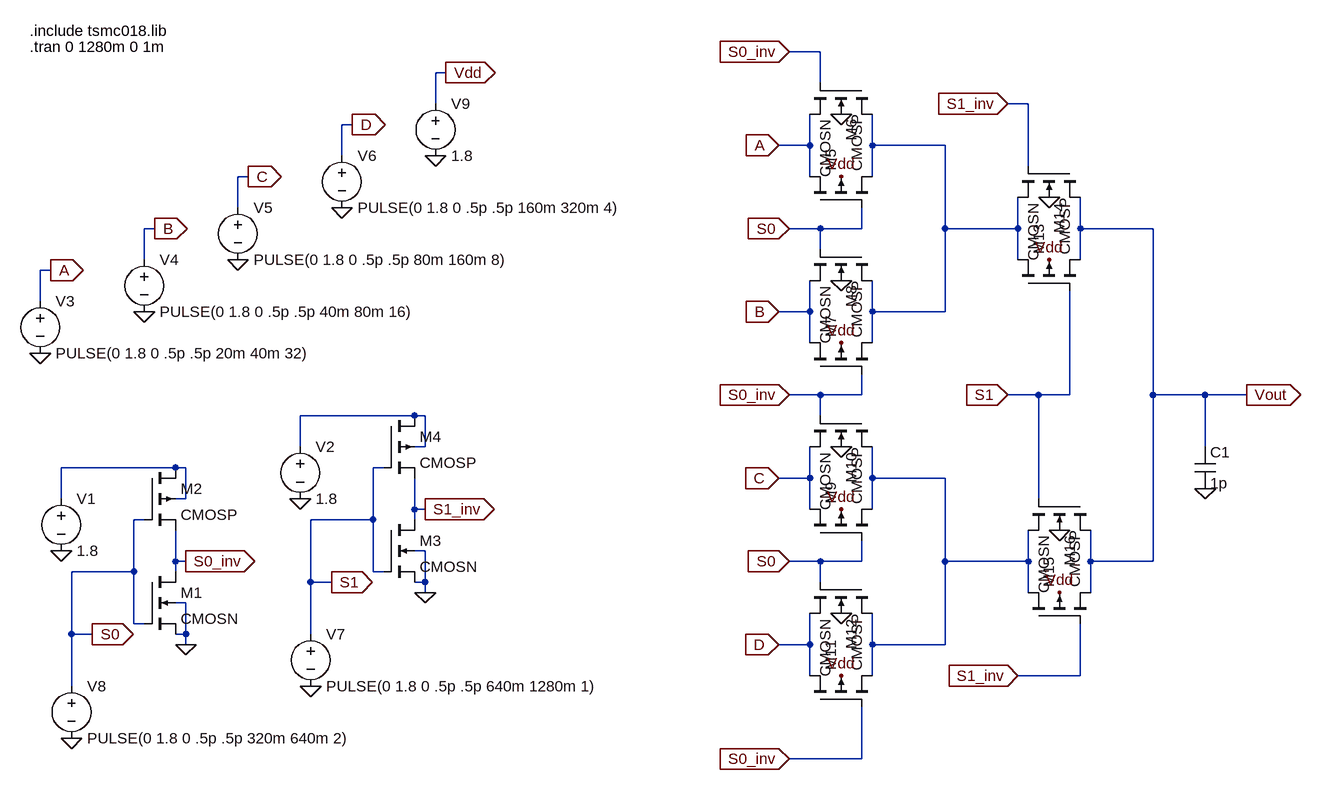
[diagram p0: schematic MUX.asc]
MUX.asc, the LTspice schematic file:
Version 4
SHEET 1 1568 872
WIRE 800 -320 752 -320
WIRE 224 -288 208 -288
WIRE 800 -272 800 -320
WIRE 208 -240 208 -288
WIRE 1120 -240 1088 -240
WIRE 80 -208 64 -208
WIRE 784 -176 784 -224
WIRE 784 -176 736 -176
WIRE 880 -176 880 -224
WIRE 992 -176 880 -176
WIRE 64 -160 64 -208
WIRE 1120 -144 1120 -240
WIRE -80 -128 -96 -128
WIRE 784 -128 784 -176
WIRE 880 -128 880 -176
WIRE -96 -80 -96 -128
WIRE -224 -48 -240 -48
WIRE 800 -48 752 -48
WIRE 864 -48 864 -80
WIRE 864 -48 800 -48
WIRE 992 -48 992 -176
WIRE 1104 -48 1104 -96
WIRE 1104 -48 992 -48
WIRE 1200 -48 1200 -96
WIRE 1312 -48 1200 -48
WIRE 800 -16 800 -48
WIRE -240 0 -240 -48
WIRE 1104 0 1104 -48
WIRE 1200 0 1200 -48
WIRE -384 16 -400 16
WIRE -400 64 -400 16
WIRE 784 80 784 32
WIRE 784 80 736 80
WIRE 880 80 880 32
WIRE 992 80 992 -48
WIRE 992 80 880 80
WIRE 784 128 784 80
WIRE 880 128 880 80
WIRE 800 208 752 208
WIRE 864 208 864 176
WIRE 864 208 800 208
WIRE 1136 208 1088 208
WIRE 1184 208 1184 48
WIRE 1184 208 1136 208
WIRE 1312 208 1312 -48
WIRE 1392 208 1312 208
WIRE 1456 208 1392 208
WIRE 176 240 0 240
WIRE 192 240 176 240
WIRE 800 240 800 208
WIRE 0 288 0 240
WIRE 192 288 192 240
WIRE 192 288 176 288
WIRE 1392 288 1392 208
WIRE -192 320 -368 320
WIRE -176 320 -192 320
WIRE 128 320 112 320
WIRE 784 336 784 288
WIRE 784 336 736 336
WIRE 880 336 880 288
WIRE 992 336 880 336
WIRE -368 368 -368 320
WIRE -176 368 -176 320
WIRE -176 368 -192 368
WIRE 1136 368 1136 208
WIRE 176 384 176 336
WIRE 192 384 176 384
WIRE 784 384 784 336
WIRE 880 384 880 336
WIRE -240 400 -256 400
WIRE 112 400 112 320
WIRE 112 400 16 400
WIRE 176 400 176 384
WIRE 192 448 176 448
WIRE -192 464 -192 416
WIRE -176 464 -192 464
WIRE 800 464 752 464
WIRE 864 464 864 432
WIRE 864 464 800 464
WIRE 992 464 992 336
WIRE 1120 464 1120 416
WIRE 1120 464 992 464
WIRE 1216 464 1216 416
WIRE 1312 464 1312 208
WIRE 1312 464 1216 464
WIRE -256 480 -256 400
WIRE -256 480 -352 480
WIRE -192 480 -192 464
WIRE 112 480 112 400
WIRE 128 480 112 480
WIRE 16 496 16 400
WIRE 48 496 16 496
WIRE 192 496 192 448
WIRE 192 496 176 496
WIRE 800 496 800 464
WIRE 192 512 192 496
WIRE 1120 512 1120 464
WIRE 1216 512 1216 464
WIRE -176 528 -192 528
WIRE -256 560 -256 480
WIRE -240 560 -256 560
WIRE -352 576 -352 480
WIRE -320 576 -352 576
WIRE -176 576 -176 528
WIRE -176 576 -192 576
WIRE 16 576 16 496
WIRE -176 592 -176 576
WIRE 784 592 784 544
WIRE 784 592 736 592
WIRE 880 592 880 544
WIRE 992 592 992 464
WIRE 992 592 880 592
WIRE 784 640 784 592
WIRE 880 640 880 592
WIRE 1200 640 1200 560
WIRE 1200 640 1104 640
WIRE -352 656 -352 576
WIRE 864 768 864 688
WIRE 864 768 752 768
FLAG -320 576 S0
IOPIN -320 576 Out
FLAG -176 464 S0_inv
IOPIN -176 464 Out
FLAG -176 592 0
FLAG 48 496 S1
IOPIN 48 496 Out
FLAG 192 384 S1_inv
IOPIN 192 384 Out
FLAG 0 368 0
FLAG 192 512 0
FLAG -400 144 0
FLAG -384 16 A
IOPIN -384 16 Out
FLAG -240 80 0
FLAG -224 -48 B
IOPIN -224 -48 Out
FLAG -96 0 0
FLAG -80 -128 C
IOPIN -80 -128 Out
FLAG 64 -80 0
FLAG 80 -208 D
IOPIN 80 -208 Out
FLAG -368 448 0
FLAG -352 736 0
FLAG 16 656 0
FLAG 208 -160 0
FLAG 224 -288 Vdd
IOPIN 224 -288 Out
FLAG 832 -224 0
FLAG 832 -128 Vdd
FLAG 832 32 0
FLAG 832 128 Vdd
FLAG 832 288 0
FLAG 832 384 Vdd
FLAG 832 544 0
FLAG 832 640 Vdd
FLAG 1152 -96 0
FLAG 1152 0 Vdd
FLAG 1168 416 0
FLAG 1168 512 Vdd
FLAG 736 -176 A
IOPIN 736 -176 In
FLAG 736 80 B
IOPIN 736 80 In
FLAG 736 336 C
IOPIN 736 336 In
FLAG 736 592 D
IOPIN 736 592 In
FLAG 752 -48 S0
IOPIN 752 -48 In
FLAG 752 464 S0
IOPIN 752 464 In
FLAG 752 208 S0_inv
IOPIN 752 208 In
FLAG 752 768 S0_inv
IOPIN 752 768 In
FLAG 752 -320 S0_inv
IOPIN 752 -320 In
FLAG 1088 -240 S1_inv
IOPIN 1088 -240 In
FLAG 1104 640 S1_inv
IOPIN 1104 640 In
FLAG 1088 208 S1
IOPIN 1088 208 In
FLAG 1456 208 Vout
IOPIN 1456 208 Out
FLAG 1392 352 0
SYMBOL cmosn -240 480 R0
SYMATTR InstName M1
SYMATTR Value2 l=180n w=1u
SYMBOL cmosp -240 320 R0
SYMATTR InstName M2
SYMATTR Value2 l=180n w=2u
SYMBOL cmosn 128 400 R0
SYMATTR InstName M3
SYMATTR Value2 l=180n w=1u
SYMBOL cmosp 128 240 R0
SYMATTR InstName M4
SYMATTR Value2 l=180n w=2u
SYMBOL voltage 0 272 R0
WINDOW 123 0 0 Left 0
WINDOW 39 0 0 Left 0
SYMATTR InstName V2
SYMATTR Value 1.8
SYMBOL voltage -400 48 R0
WINDOW 123 0 0 Left 0
WINDOW 39 0 0 Left 0
SYMATTR InstName V3
SYMATTR Value PULSE(0 1.8 0 .5p .5p 20m 40m 32)
SYMBOL voltage -240 -16 R0
WINDOW 123 0 0 Left 0
WINDOW 39 0 0 Left 0
SYMATTR InstName V4
SYMATTR Value PULSE(0 1.8 0 .5p .5p 40m 80m 16)
SYMBOL voltage -96 -96 R0
WINDOW 123 0 0 Left 0
WINDOW 39 0 0 Left 0
SYMATTR InstName V5
SYMATTR Value PULSE(0 1.8 0 .5p .5p 80m 160m 8)
SYMBOL voltage 64 -176 R0
WINDOW 123 0 0 Left 0
WINDOW 39 0 0 Left 0
SYMATTR InstName V6
SYMATTR Value PULSE(0 1.8 0 .5p .5p 160m 320m 4)
SYMBOL voltage -368 352 R0
WINDOW 123 0 0 Left 0
WINDOW 39 0 0 Left 0
SYMATTR InstName V1
SYMATTR Value 1.8
SYMBOL voltage -352 640 R0
WINDOW 123 0 0 Left 0
WINDOW 39 0 0 Left 0
SYMATTR InstName V8
SYMATTR Value PULSE(0 1.8 0 .5p .5p 320m 640m 2)
SYMBOL voltage 16 560 R0
WINDOW 123 0 0 Left 0
WINDOW 39 0 0 Left 0
SYMATTR InstName V7
SYMATTR Value PULSE(0 1.8 0 .5p .5p 640m 1280m 1)
SYMBOL cmosp 784 -80 R270
SYMATTR InstName M5
SYMATTR Value2 l=180nm w=2u
SYMBOL cmosn 880 -272 R90
SYMATTR InstName M6
SYMATTR Value2 l=180nm w=1u
SYMBOL voltage 208 -256 R0
WINDOW 123 0 0 Left 0
WINDOW 39 0 0 Left 0
SYMATTR InstName V9
SYMATTR Value 1.8
SYMBOL cmosp 784 176 R270
SYMATTR InstName M7
SYMATTR Value2 l=180nm w=2u
SYMBOL cmosn 880 -16 R90
SYMATTR InstName M8
SYMATTR Value2 l=180nm w=1u
SYMBOL cmosp 784 432 R270
SYMATTR InstName M9
SYMATTR Value2 l=180nm w=2u
SYMBOL cmosn 880 240 R90
SYMATTR InstName M10
SYMATTR Value2 l=180nm w=1u
SYMBOL cmosp 784 688 R270
SYMATTR InstName M11
SYMATTR Value2 l=180nm w=2u
SYMBOL cmosn 880 496 R90
SYMATTR InstName M12
SYMATTR Value2 l=180nm w=1u
SYMBOL cmosp 1104 48 R270
SYMATTR InstName M13
SYMATTR Value2 l=180nm w=2u
SYMBOL cmosn 1200 -144 R90
SYMATTR InstName M14
SYMATTR Value2 l=180nm w=1u
SYMBOL cmosp 1120 560 R270
SYMATTR InstName M15
SYMATTR Value2 l=180nm w=2u
SYMBOL cmosn 1216 368 R90
SYMATTR InstName M16
SYMATTR Value2 l=180nm w=1u
SYMBOL cap 1376 288 R0
SYMATTR InstName C1
SYMATTR Value 1p
TEXT -416 -352 Left 2 !.include tsmc018.lib
TEXT -416 -328 Left 2 !.tran 0 1280m 0 1m

The netlist it stands for:
* MUX.asc
M1 S0_inv S0 0 0 CMOSN l=180n w=1u
M2 N003 S0 S0_inv N003 CMOSP l=180n w=2u
M3 S1_inv S1 0 0 CMOSN l=180n w=1u
M4 N002 S1 S1_inv N002 CMOSP l=180n w=2u
V2 N002 0 1.8
V3 A 0 PULSE(0 1.8 0 .5p .5p 20m 40m 32)
V4 B 0 PULSE(0 1.8 0 .5p .5p 40m 80m 16)
V5 C 0 PULSE(0 1.8 0 .5p .5p 80m 160m 8)
V6 D 0 PULSE(0 1.8 0 .5p .5p 160m 320m 4)
V1 N003 0 1.8
V8 S0 0 PULSE(0 1.8 0 .5p .5p 320m 640m 2)
V7 S1 0 PULSE(0 1.8 0 .5p .5p 640m 1280m 1)
M5 A S0 N001 Vdd CMOSP l=180nm w=2u
M6 N001 S0_inv A 0 CMOSN l=180nm w=1u
V9 Vdd 0 1.8
M7 B S0_inv N001 Vdd CMOSP l=180nm w=2u
M8 N001 S0 B 0 CMOSN l=180nm w=1u
M9 C S0 N004 Vdd CMOSP l=180nm w=2u
M10 N004 S0_inv C 0 CMOSN l=180nm w=1u
M11 D S0_inv N004 Vdd CMOSP l=180nm w=2u
M12 N004 S0 D 0 CMOSN l=180nm w=1u
M13 N001 S1 Vout Vdd CMOSP l=180nm w=2u
M14 Vout S1_inv N001 0 CMOSN l=180nm w=1u
M15 N004 S1_inv Vout Vdd CMOSP l=180nm w=2u
M16 Vout S1 N004 0 CMOSN l=180nm w=1u
C1 Vout 0 1p
.model NMOS NMOS
.model PMOS PMOS
.lib standard.mos
.include tsmc018.lib
.tran 0 1280m 0 1m
.backanno
.end